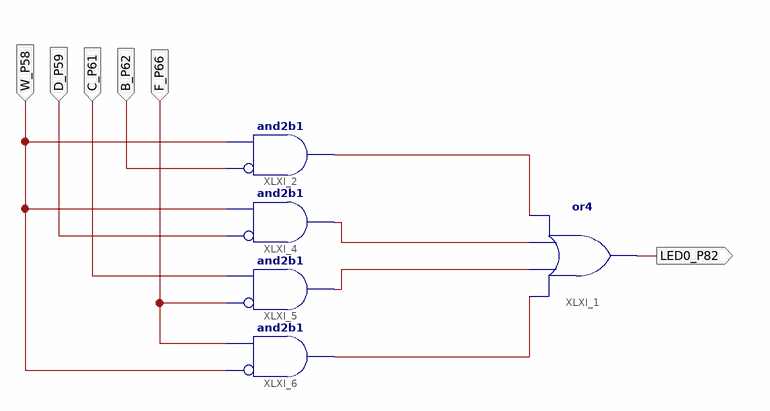
[diagram p0: schematic sheet 1]
// Xilinx ISE schematic sch_3.sch (spartan6) as structural Verilog: 5 symbols, 6 ports
module sch_3 (
  input  W_P58,
  input  D_P59,
  input  C_P61,
  input  B_P62,
  input  F_P66,
  output LED0_P82
);

  wire XLXN_7, XLXN_9, XLXN_10, XLXN_11;

  or XLXI_1 (LED0_P82, XLXN_11, XLXN_10, XLXN_9, XLXN_7);
  and XLXI_2 (XLXN_7, ~B_P62, W_P58);  // and2b1
  and XLXI_4 (XLXN_9, ~D_P59, W_P58);  // and2b1
  and XLXI_5 (XLXN_10, ~F_P66, C_P61);  // and2b1
  and XLXI_6 (XLXN_11, ~W_P58, F_P66);  // and2b1
endmodule
